# EAGLE design rtkSchematic (EAGLE 9.6.2)
AUTHOR: Alexander Dunn; BOARD_NAME: RTK Board; PROJECT_NAME: RTK
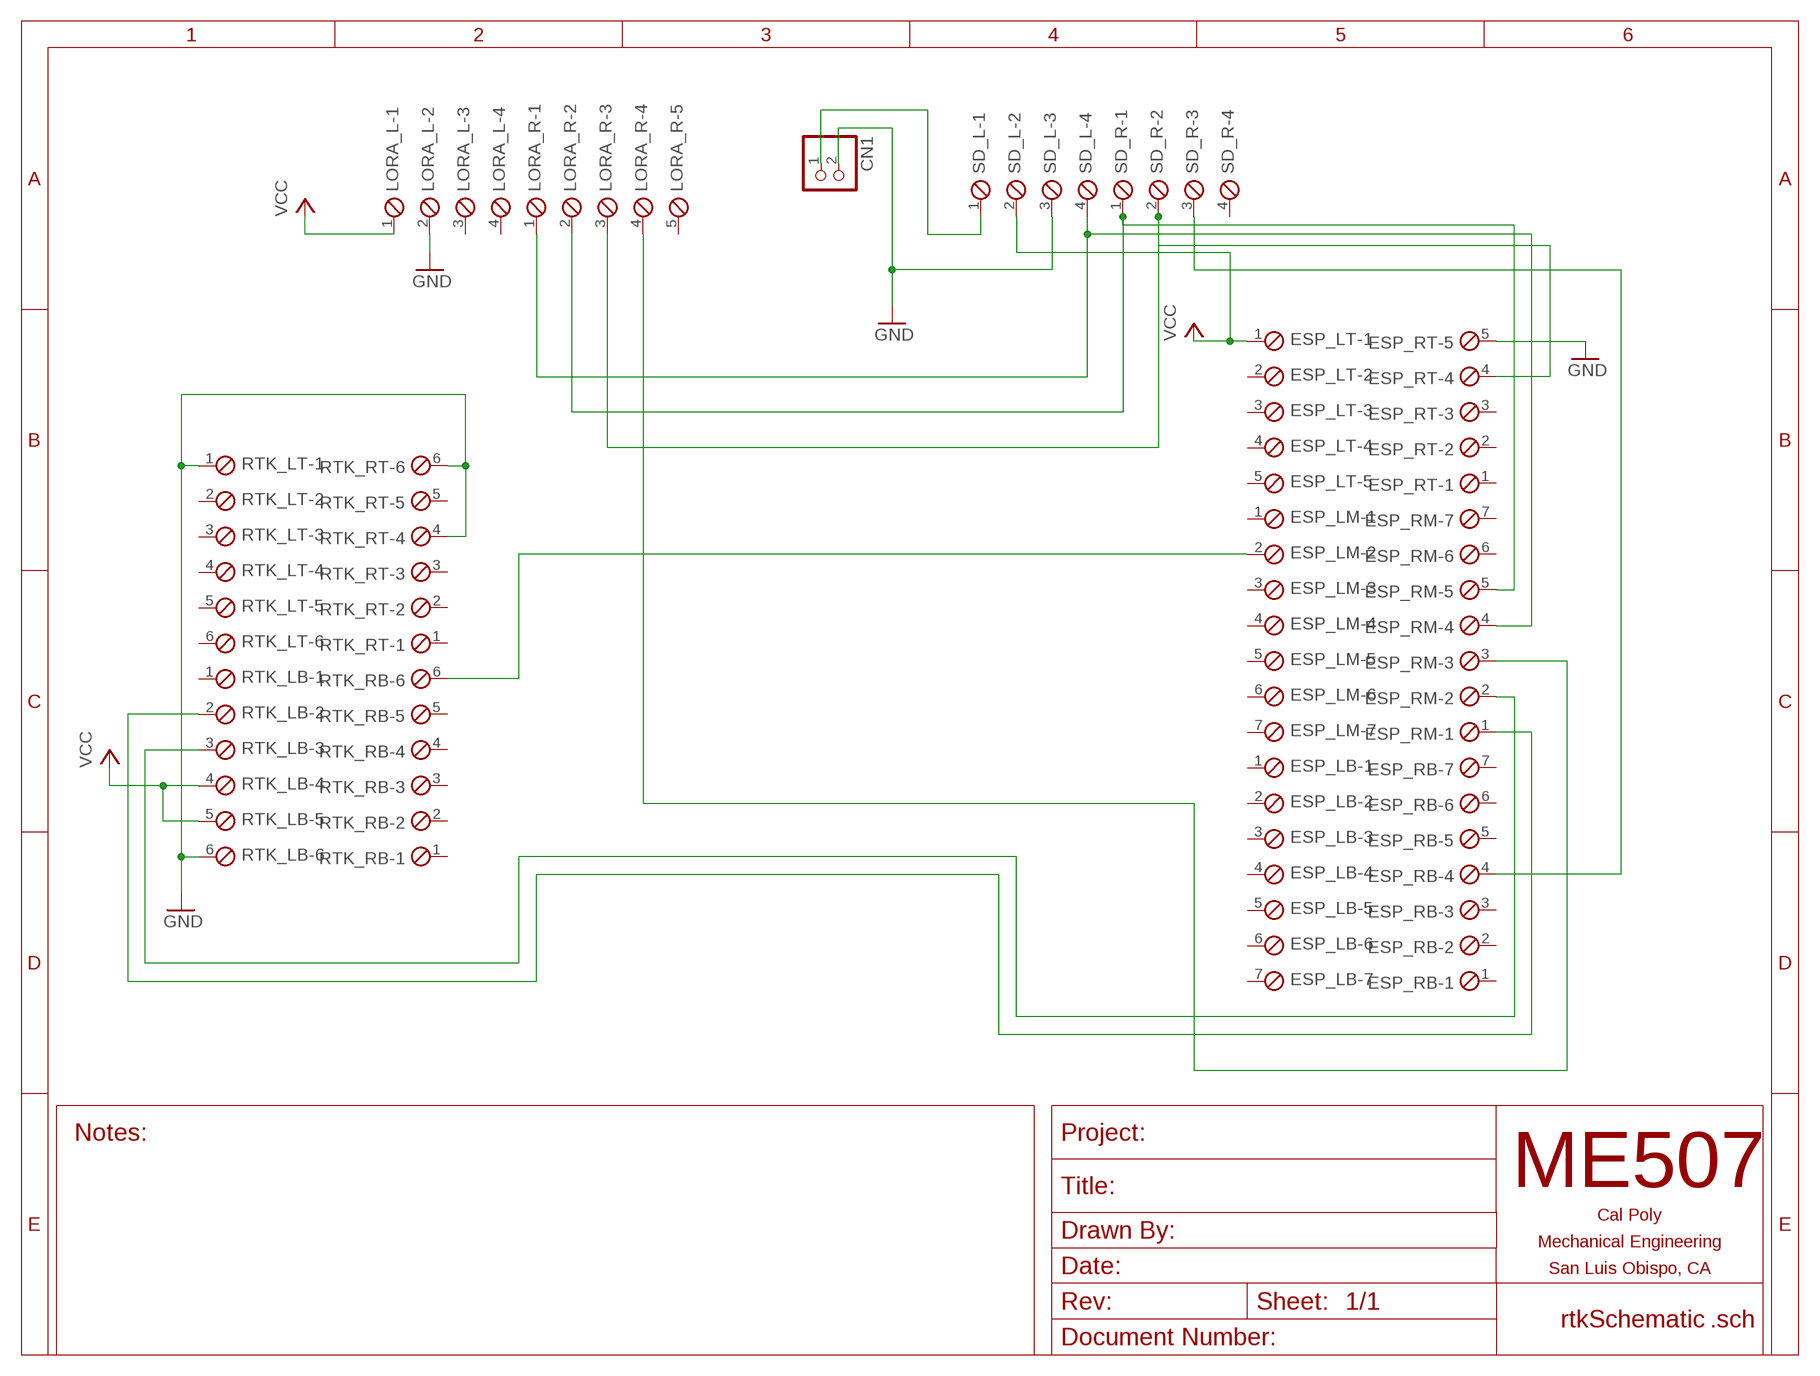
[diagram p0: schematic, sheet 1]

## Parts
CN1  JST_2PIN-SMT-RA  [JST-PH-2-SMT-RA]
ESP_LB  SCREWTERM_7P_254  [7POL254]
ESP_LM  SCREWTERM_7P_254  [7POL254]
ESP_LT  SCREWTERM_5P_254  [5POL254]
ESP_RB  SCREWTERM_7P_254  [7POL254]
ESP_RM  SCREWTERM_7P_254  [7POL254]
ESP_RT  SCREWTERM_5P_254  [5POL254]
LORA_L  SCREWTERM_4P_254  [4POL254]
LORA_R  SCREWTERM_5P_254  [5POL254]
RTK_LB  SCREWTERM_6P_254  [6POL254]
RTK_LT  SCREWTERM_6P_254  [6POL254]
RTK_RB  SCREWTERM_6P_254  [6POL254]
RTK_RT  SCREWTERM_6P_254  [6POL254]
SD_L  SCREWTERM_4P_254  [4POL254]
SD_R  SCREWTERM_4P_254  [4POL254]

## Nets
GND: CN1.2 ESP_RT.5 LORA_L.2 RTK_LB.6 RTK_LT.1 RTK_RT.4 RTK_RT.6 SD_L.3
N$1: ESP_LM.2 RTK_RB.6
N$3: CN1.1 SD_L.1
N$4: ESP_RM.4 LORA_R.1 SD_L.4
N$5: ESP_RM.5 LORA_R.2 SD_R.1
N$6: ESP_RT.4 LORA_R.3 SD_R.2
N$7: ESP_RB.4 SD_R.3
N$8: ESP_RM.2 RTK_LB.3
N$9: ESP_RM.1 RTK_LB.2
N$10: ESP_RM.3 LORA_R.4
VCC: ESP_LT.1 LORA_L.1 RTK_LB.4 RTK_LB.5 SD_L.2
Unconnected: ESP_LB.1 ESP_LB.2 ESP_LB.3 ESP_LB.4 ESP_LB.5 ESP_LB.6 ESP_LB.7 ESP_LM.1 ESP_LM.3 ESP_LM.4 ESP_LM.5 ESP_LM.6 ESP_LM.7 ESP_LT.2 ESP_LT.3 ESP_LT.4 ESP_LT.5 ESP_RB.1 ESP_RB.2 ESP_RB.3 ESP_RB.5 ESP_RB.6 ESP_RB.7 ESP_RM.6 ESP_RM.7 ESP_RT.1 ESP_RT.2 ESP_RT.3 LORA_L.3 LORA_L.4 LORA_R.5 RTK_LB.1 RTK_LT.2 RTK_LT.3 RTK_LT.4 RTK_LT.5 RTK_LT.6 RTK_RB.1 RTK_RB.2 RTK_RB.3 RTK_RB.4 RTK_RB.5 RTK_RT.1 RTK_RT.2 RTK_RT.3 RTK_RT.5 SD_R.4

## Library data of the parts
CN1 = adafruit:JST_2PIN: JST 2-Pin Connectors of various flavors SMT-RA (S2B-PH-SM4) 4UConnector #17311 SMT (B2B-PH-SM4) THM-RA (S2B-PH) THM (B2B-PH)
ESP_LB ESP_LM ESP_RB ESP_RM = ME507:SCREWTERM_7P: Screw Terminal Block This part is designed for a screw terminal connector. The 2.54mm (0.100 inch) foorprint can also be used for male or female pin headers such as those on most development boards. One can also solder wires directly into the holes, though this makes modifications or repairs to the system more inconvenient. Larger versions can carry more current.
ESP_LT ESP_RT LORA_R = ME507:SCREWTERM_5P: Screw Terminal Block This part is designed for a screw terminal connector. The 2.54mm (0.100 inch) foorprint can also be used for male or female pin headers such as those on most development boards. One can also solder wires directly into the holes, though this makes modifications or repairs to the system more inconvenient. Larger versions can carry more current.
LORA_L SD_L SD_R = ME507:SCREWTERM_4P: Screw Terminal Block This part is designed for a screw terminal connector. The 2.54mm (0.100 inch) foorprint can also be used for male or female pin headers such as those on most development boards. One can also solder wires directly into the holes, though this makes modifications or repairs to the system more inconvenient. Larger versions can carry more current.
RTK_LB RTK_LT RTK_RB RTK_RT = ME507:SCREWTERM_6P: Screw Terminal Block This part is designed for a screw terminal connector. The 2.54mm (0.100 inch) foorprint can also be used for male or female pin headers such as those on most development boards. One can also solder wires directly into the holes, though this makes modifications or repairs to the system more inconvenient. Larger versions can carry more current.

## Board
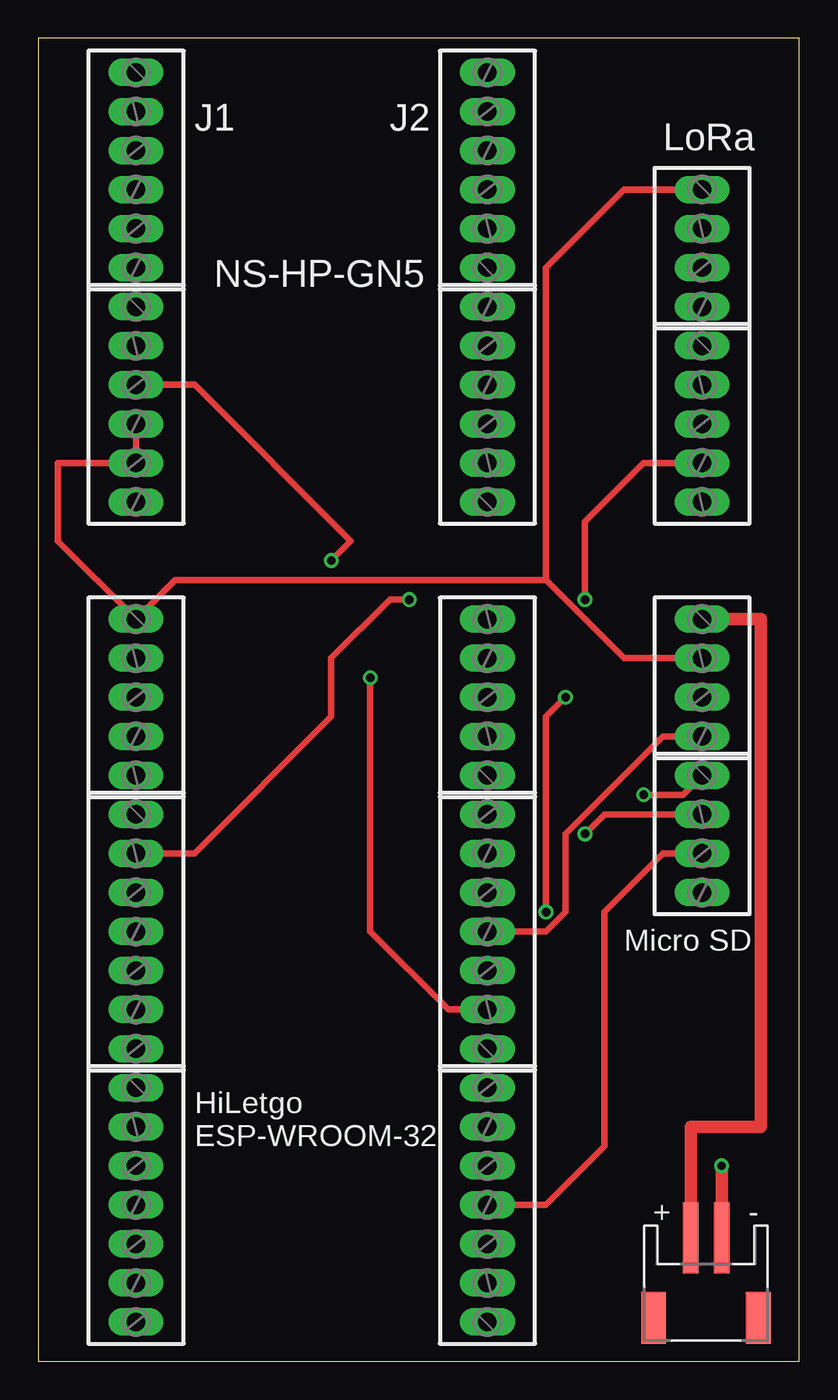
[diagram p1: board, top side]
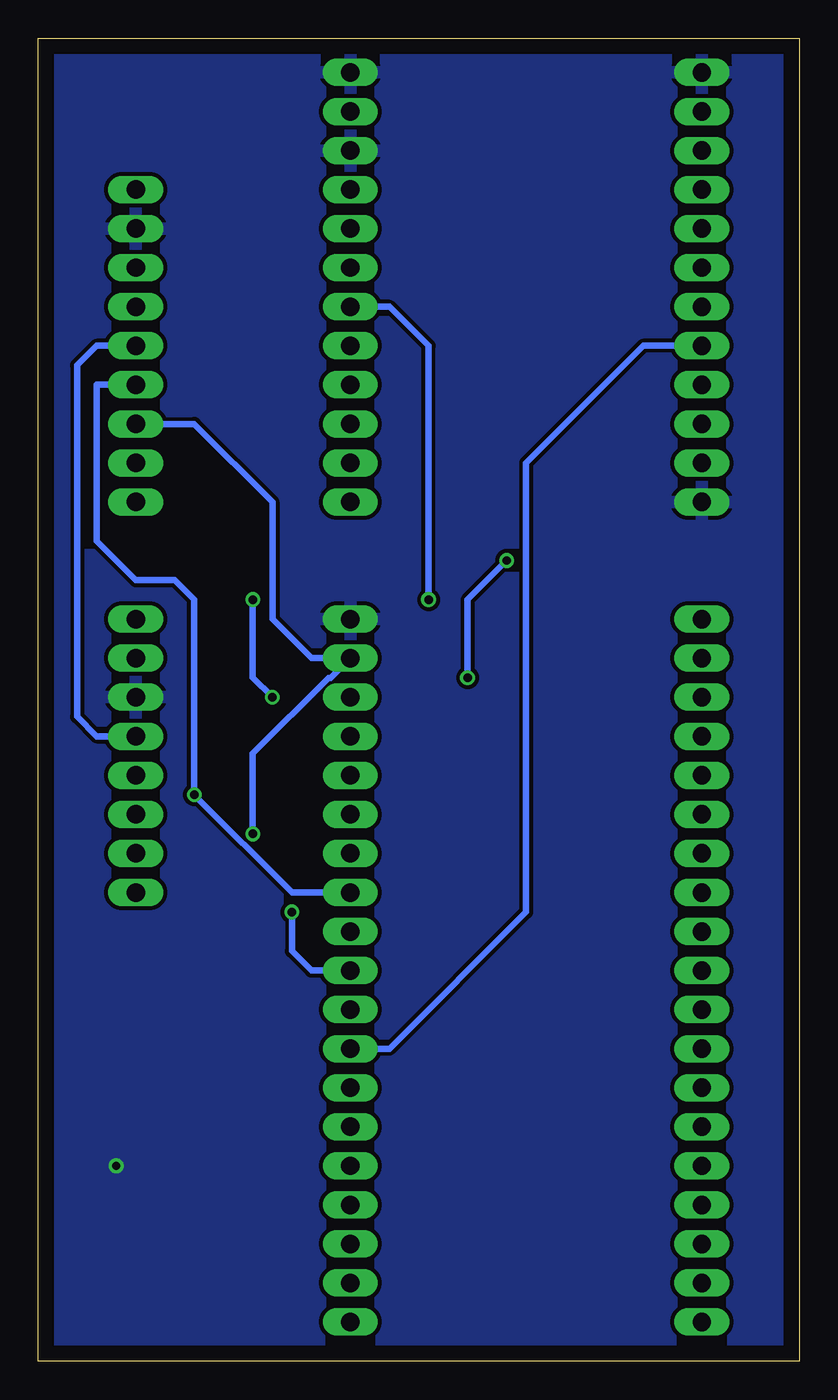
[diagram p2: board, bottom side, seen from below]

Size 49.51 x 86.03 mm. Coordinates in mm from the lower left corner, seen from the top.
Outline: 0,0 49.51,0 49.51,86.03 0,86.03 0,0
Copper layers (1*16): Top 0.035mm / dielectric 1.5mm / Bottom 0.035mm
Design rules "default": minimum track width 6mil, minimum drill 0.35mm, track to track 6mil, track to pad 6mil, pad to pad 6mil, via to via 6mil, smd to smd 6mil, copper to edge 40mil, drill to drill 6mil, minimum pad ring 10mil, minimum via ring 8mil, stop-mask expansion 4mil, vias tented up to drill 0mil, thermal gap 10mil

### Footprints (pad centres in the part's own frame; a part is rotated, then mirrored left to right if it is on the bottom)
JST-PH-2-SMT-RA = smd 1 x 4.6: 1 1,-3.7; 2 -1,-3.7 | smd 1.6 x 3.4: NC1 -3.4,1.5; NC2 3.4,1.5
7POL254 = drill 1.2 long: 1 -7.62,0; 2 -5.08,0; 3 -2.54,0; 4 0,0; 5 2.54,0; 6 5.08,0; 7 7.62,0
5POL254 = drill 1.2 long: 1 -5.08,0; 2 -2.54,0; 3 0,0; 4 2.54,0; 5 5.08,0
4POL254 = drill 1.2 long: 1 -3.81,0; 2 -1.27,0; 3 1.27,0; 4 3.81,0
6POL254 = drill 1.2 pad 1.778 long: 1 -6.35,0; 2 -3.81,0; 3 -1.27,0; 4 1.27,0; 5 3.81,0; 6 6.35,0

### Placement (x,y rotation side)
CN1  43.43,4.32 180 top
ESP_LB  6.35,10.16 270 top
ESP_LM  6.35,27.94 270 top
ESP_LT  6.35,43.18 270 top
ESP_RB  29.21,10.16 90 top
ESP_RM  29.21,27.94 90 top
ESP_RT  29.21,43.18 90 top
LORA_L  43.18,72.39 270 top
LORA_R  43.18,60.96 270 top
RTK_LB  6.35,62.23 270 top
RTK_LT  6.35,77.47 270 top
RTK_RB  29.21,62.23 90 top
RTK_RT  29.21,77.47 90 top
SD_L  43.18,44.45 270 top
SD_R  43.18,34.29 270 top

### Tracks (layer width: path | path; a pad name or v marks a point on that pad's centre or on a via)
GND  (via drill 0.55)
  Top 0.813: v44.45,12.7 44.45,8.03 CN1.2
  pour Bottom (isolate 0.254, rank 5): 0,86.36 0,0 49.53,0 49.53,86.36
N$1  (via drill 0.55)
  Top 0.406: ESP_LM.2 10.16,33.02 19.05,41.91 19.05,45.72 22.86,49.53 v24.13,49.53
  Bottom 0.406: v24.13,49.53 24.13,66.04 26.67,68.58 RTK_RB.6
N$3
  Top 0.813: SD_L.1 46.99,48.26 46.99,15.24 42.43,15.24 CN1.1
N$4
  Top 0.406: SD_L.4 40.64,40.64 34.29,34.29 34.29,29.21 33.02,27.94 ESP_RM.4
  Bottom 0.406: LORA_R.1 45.72,66.04 46.99,64.77 46.99,41.91 45.72,40.64 SD_L.4
N$5  (via drill 0.55)
  Top 0.406: SD_R.1 41.91,36.83 v39.37,36.83
  Bottom 0.406: ESP_RM.5 33.02,30.48 v39.37,36.83 39.37,49.53 40.64,50.8 43.18,50.8 45.72,53.34 45.72,63.5 LORA_R.2
N$6  (via drill 0.55)
  Top 0.406: v35.56,34.29 36.83,35.56 SD_R.2
  Bottom 0.406: v35.56,34.29 35.56,39.51 30.63,44.44 30.49,44.44 ESP_RT.4 31.75,45.72 34.29,48.26 34.29,55.88 39.37,60.96 LORA_R.3
N$7
  Top 0.406: SD_R.3 40.64,33.02 36.83,29.21 36.83,13.97 33.02,10.16 ESP_RB.4
N$8  (via drill 0.55)
  Top 0.406: RTK_LB.3 10.16,63.5 20.32,53.34 v19.05,52.07 | v21.59,44.45 21.59,27.94 26.67,22.86 ESP_RM.2
  Bottom 0.406: v19.05,52.07 21.59,49.53 v21.59,44.45
N$9
  Bottom 0.406: RTK_LB.2 10.16,66.04 17.78,58.42 17.78,29.21 26.67,20.32 ESP_RM.1
N$10  (via drill 0.55)
  Top 0.406: LORA_R.4 39.37,58.42 35.56,54.61 v35.56,49.53 | v34.29,43.18 33.02,41.91 v33.02,29.21
  Bottom 0.406: v35.56,49.53 35.56,44.45 v34.29,43.18 | v33.02,29.21 33.02,26.67 31.75,25.4 ESP_RM.3
VCC
  Top 0.406: SD_L.2 38.1,45.72 33.02,50.8 | 33.02,50.8 8.89,50.8 ESP_LT.1 1.27,53.34 1.27,58.42 RTK_LB.5 RTK_LB.4 | LORA_L.1 38.1,76.2 33.02,71.12 33.02,50.8

### Text on the board
tNames: J1 | J2 | LoRa | NS-HP-GN5 | Micro SD | HiLetgo / ESP-WROOM-32